# Altium schematic sheet 01_GAP9_INTERFACE.SchDoc: GAP9Shield
size A3; DrawnBy: Hanna Müller and Victor Kartsch; Organization: Integrated Systems Laboratory; DocumentNumber: 1; Revision: v1.0; SheetNumber: 1; SheetTotal: 9
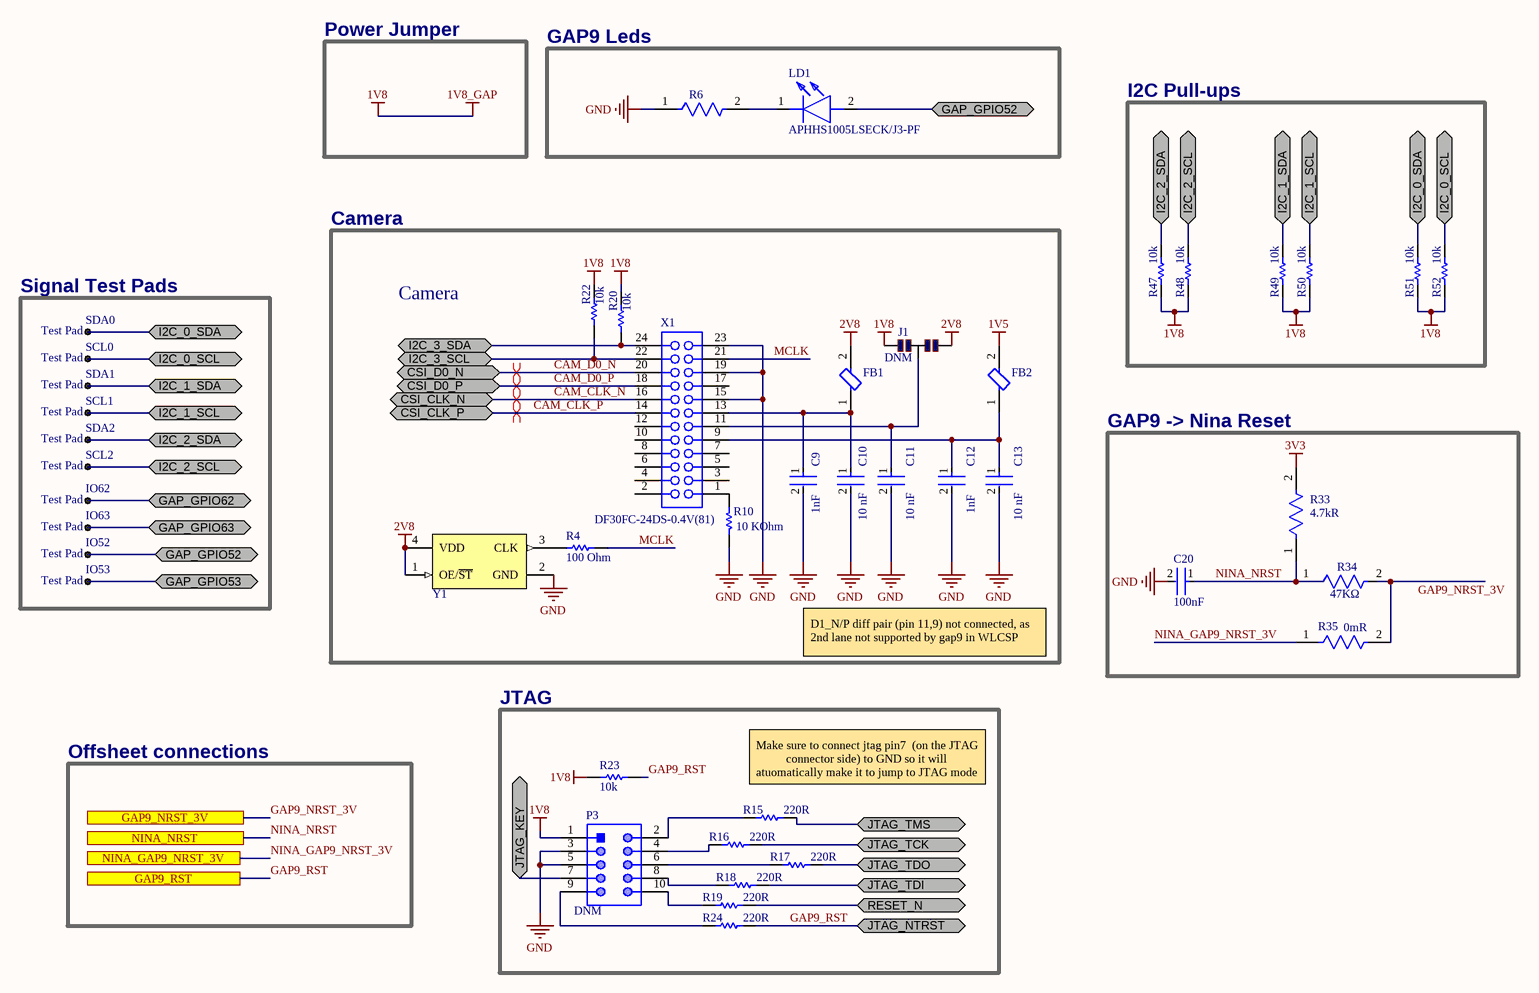
[diagram p0: 01_GAP9_INTERFACE.SchDoc]

## Parts
C9  value 1nF  [FP-GRM155-0_05-IPC_B]  (hidden comment: C0402C102F5GECAUTO)
C10  Capacitance: 10 nF  [FP-CC0402-MFG]  (hidden comment: CC0402KRX7R7BB103)
C11  Capacitance: 10 nF  [FP-CC0402-MFG]  (hidden comment: CC0402KRX7R7BB103)
C12  value 1nF  [FP-GRM155-0_05-IPC_B]  (hidden comment: C0402C102F5GECAUTO)
C13  Capacitance: 10 nF  [FP-CC0402-MFG]  (hidden comment: CC0402KRX7R7BB103)
C20  value 100nF  [FP-C1005-050-0_05-MFG]  (hidden comment: C1005X5R1E104K050BC)
FB1  BLM18HE152SN1D  [FP-BLM18-0_15-t0_8-IPC_C]  (value not drawn)
FB2  BLM18HE152SN1D  [FP-BLM18-0_15-t0_8-IPC_C]  (value not drawn)
IO52  Test Pad  [Pad-1.5mm]  (no BOM)
IO53  Test Pad  [Pad-1.5mm]  (no BOM)
IO62  Test Pad  [Pad-1.5mm]  (no BOM)
IO63  Test Pad  [Pad-1.5mm]  (no BOM)
J1  DNM  [Jumper 3 pins]  (no BOM)
LD1  APHHS1005LSECK/J3-PF  [APHHS1005LSECKJ3PF]
P3  DNM  [2x10Pin_Horizontal_50mil]
R4  value 100 Ohm  [RESC1005X40X25LL05T05]  (hidden comment: ERJ-2RKF1000X)
R6  RC0201JR-070RL  [FP-RC_L0201-MFG]  (value not drawn)
R10  value 10 KOhm  [RESC1005X40X25NL05T05]  (hidden comment: ERJ-2RKF1002X)
R15  value 220R  [RESC0603X28X15ML05T05]  (hidden comment: CRCW0201220RFKED)
R16  value 220R  [RESC0603X28X15ML05T05]  (hidden comment: CRCW0201220RFKED)
R17  value 220R  [RESC0603X28X15ML05T05]  (hidden comment: CRCW0201220RFKED)
R18  value 220R  [RESC0603X28X15ML05T05]  (hidden comment: CRCW0201220RFKED)
R19  value 220R  [RESC0603X28X15ML05T05]  (hidden comment: CRCW0201220RFKED)
R20  value 10k  [RESC0603X28X15LL05T05]  (hidden comment: CRCW020110K0FNED)
R22  value 10k  [RESC0603X28X15LL05T05]  (hidden comment: CRCW020110K0FNED)
R23  value 10k  [RESC0603X28X15LL05T05]  (hidden comment: CRCW020110K0FNED)
R24  value 220R  [RESC0603X28X15ML05T05]  (hidden comment: CRCW0201220RFKED)
R33  value 4.7kR  [FP-CRCW0402-e3-IPC_B]  (hidden comment: CRCW04024K70FKED)
R34  value 47KΩ  [FP-CRGCQ0402-IPC_C]  (hidden comment: CRGCQ0402F47K)
R35  value 0mR  [FP-CRCW0402-e3-IPC_C]  (hidden comment: CRCW04020000Z0ED)
R47  value 10k  [RESC0603X28X15LL05T05]  (hidden comment: CRCW020110K0FNED)
R48  value 10k  [RESC0603X28X15LL05T05]  (hidden comment: CRCW020110K0FNED)
R49  value 10k  [RESC0603X28X15LL05T05]  (hidden comment: CRCW020110K0FNED)
R50  value 10k  [RESC0603X28X15LL05T05]  (hidden comment: CRCW020110K0FNED)
R51  value 10k  [RESC0603X28X15LL05T05]  (hidden comment: CRCW020110K0FNED)
R52  value 10k  [RESC0603X28X15LL05T05]  (hidden comment: CRCW020110K0FNED)
SCL0  Test Pad  [Pad-1.5mm]  (no BOM)
SCL1  Test Pad  [Pad-1.5mm]  (no BOM)
SCL2  Test Pad  [Pad-1.5mm]  (no BOM)
SDA0  Test Pad  [Pad-1.5mm]  (no BOM)
SDA1  Test Pad  [Pad-1.5mm]  (no BOM)
SDA2  Test Pad  [Pad-1.5mm]  (no BOM)
X1  DF30FC-24DS-0.4V(81)  [DF30FC-24DS-0.4V(81)]
Y1  KC2520K25.0000C1GE00  [AB-24.000MAGE-T]  (value not drawn)

## Blocks framed on the sheet
GAP9 Leds: LD1 R6
I2C Pull-ups: R47-R52
Signal Test Pads: IO52 IO53 IO62 IO63 SCL0-SCL2 SDA0-SDA2
GAP9 -> Nina Reset: C20 R33-R35
JTAG: P3 R15-R19 R23 R24

## Ports
CSI_CLK_N (bidir), CSI_CLK_P (bidir), CSI_D0_N (bidir), CSI_D0_P (bidir), GAP9_NRST_3V, GAP9_RST, GAP_GPIO52 (bidir), GAP_GPIO53 (bidir), GAP_GPIO62 (bidir), GAP_GPIO63 (bidir), I2C_0_SCL (bidir), I2C_0_SDA (bidir), I2C_1_SCL (bidir), I2C_1_SDA (bidir), I2C_2_SCL (bidir), I2C_2_SDA (bidir), I2C_3_SCL (bidir), I2C_3_SDA (bidir), JTAG_KEY (bidir), JTAG_NTRST (bidir), JTAG_TCK (bidir), JTAG_TDI (bidir), JTAG_TDO (bidir), JTAG_TMS (bidir), NINA_GAP9_NRST_3V, NINA_NRST, RESET_N (bidir)

## Nets
1V5: FB2.2
1V8: J1.1 P3.1 R20.2 R22.2 R23.1 R47.1 R48.1 R49.1 R50.1 R51.1 R52.1  [also labelled 1V8_GAP]
2V8: FB1.2 J1.3 Y1.1(OE/~{ST}) Y1.4(VDD)
3V3: R33.2
GND: C9.2 C10.2 C11.2 C12.2 C13.2 C20.2 P3.3 P3.5 R6.1 R10.2 X1.15 X1.19 X1.23 Y1.2(GND)
CAM_CLK_N: X1.16 ; port CSI_CLK_N
CAM_CLK_P: X1.14 ; port CSI_CLK_P
CAM_D0_N: X1.20 ; port CSI_D0_N
CAM_D0_P: X1.18 ; port CSI_D0_P
GAP9_NRST_3V: R34.2 R35.2 ; port GAP9_NRST_3V
GAP9_RST: R23.2 R24.2 ; port JTAG_NTRST, port GAP9_RST
GAP_GPIO52: IO52.1 LD1.2(A) ; port GAP_GPIO52
GAP_GPIO53: IO53.1 ; port GAP_GPIO53
GAP_GPIO62: IO62.1 ; port GAP_GPIO62
GAP_GPIO63: IO63.1 ; port GAP_GPIO63
I2C_0_SCL: R52.2 SCL0.1 ; port I2C_0_SCL
I2C_0_SDA: R51.2 SDA0.1 ; port I2C_0_SDA
I2C_1_SCL: R50.2 SCL1.1 ; port I2C_1_SCL
I2C_1_SDA: R49.2 SDA1.1 ; port I2C_1_SDA
I2C_2_SCL: R48.2 SCL2.1 ; port I2C_2_SCL
I2C_2_SDA: R47.2 SDA2.1 ; port I2C_2_SDA
I2C_3_SCL: R22.1 X1.22 ; port I2C_3_SCL
I2C_3_SDA: R20.1 X1.24 ; port I2C_3_SDA
JTAG_KEY: P3.7 ; port JTAG_KEY
JTAG_TCK: R16.2 ; port JTAG_TCK
JTAG_TDI: R18.2 ; port JTAG_TDI
JTAG_TDO: R17.2 ; port JTAG_TDO
JTAG_TMS: R15.2 ; port JTAG_TMS
MCLK: R4.1 X1.21
NINA_GAP9_NRST_3V: R35.1 ; port NINA_GAP9_NRST_3V
NINA_NRST: C20.1 R33.1 R34.1 ; port NINA_NRST
RESET_N: R19.2 ; port RESET_N
NetC9_1: C9.1 C10.1 FB1.1 X1.13
NetC11_1: C11.1 J1.2 X1.11
NetC12_1: C12.1 C13.1 FB2.1 X1.9
NetLD1_1: LD1.1(K) R6.2
NetP3_2: P3.2 R15.1
NetP3_4: P3.4 R16.1
NetP3_6: P3.6 R17.1
NetP3_8: P3.8 R18.1
NetP3_9: P3.9 R24.1
NetP3_10: P3.10 R19.1
NetR4_2: R4.2 Y1.3(CLK)
NetR10_1: R10.1 X1.1

Not connected (* = marked no-connect by the designer): X1 2 3 4 5 6 7 8 10 12 17

## Layout directives
differential pair: CAM_CLK_N, CAM_CLK_P, CAM_D0_N, CAM_D0_P

## Notes on the sheet
- Power Jumper
- Camera
- D1_N/P diff pair (pin 11,9) not connected, as 2nd lane not supported by gap9 in WLCSP
- Offsheet connections
- (near R15) Make sure to connect jtag pin7  (on the JTAG connector side) to GND so it will atuomatically make it to jump to JTAG mode
- 1
- 2
- 3
- 4
- 5
- 6
- 7
- 8
- A
- B
- C
- D
- Project:
- Date:
- Drawing number:
- Rev:
- Format:
- A3
- Drawn by:
- Laboratory:
- Page
- Sheet:
- of
- File:

## Library data of the parts
C9 C12 = CMP-2008-04254-2: Chip Multilayer Ceramic Capacitors for General Purpose, 0402, 1000pF, C0G, 30ppm/°C, 5%, 50V; Insulation Resistance: 10GR; Packaging: Tape and Reel; Lead Free: Lead Free; Tolerance: 5%; Temperature Coefficient: 30ppm/°C; Thickness: 0.022inch; Termination: SMD/SMT; Max Operating Temperature: 125°C; Height: 0.5mm; Package Quantity: 1; Radiation Hardening: No; Material: Ceramic; Case Code (Metric): 1005; Number of Pins: 2; Voltage Rating: 50V; Mount: Surface Mount; Voltage: 50V; Case/Package: 0402; Min Operating Temperature: -55°C; Dielectric Material: Ceramic; Width: 0.5mm; Depth: 0.5mm; Case Code (Imperial): 0402; REACH SVHC: No SVHC; Dielectric: C0G; Capacitance: 1nF; Voltage Rating (DC): 50V; Length: 1mm
C10 C11 C13 = CMP-03422-000501-1: CAP CER 10000PF 16V X7R 0402; Manufacturer: YAGEO; Automotive Grade: NA; Material: Ceramic; Value: 10 nF; Tolerance: 0.1; Temperature Coefficient: 30ppm/°C; Temperature Range Low: -55°C; Temperature Range High: +125°C; Mouser Description: 0402 10 nF 16 V ±10 % Tolerance X7R SMT Multilayer Ceramic Capacitor; Footprint Url: http://www.yageo.com/exep/pages/download/literatures/UPY-C_GEN_24.pdf; Category: Cap; RoHS: TRUE; Manufacturer Part Number: CC0402KRX7R7BB103; ComponentLink2Description: Datasheet; Ipc Land Pattern Name: CAPC10050X50; Automotive: No; ComponentLink2URL: http://www.yageo.com/documents/recent/UPY-GP_NP0_16V-to-50V_16.pdf; Device Class L1: Passive Components; Height: 0.55mm; Temperature Characteristic: X7R; Package: CC0402; Voltage Rating: 16 V; Device Class L3: Ceramic Capacitors; Lead Free: Yes; Device Class L2: Capacitors; Digikey Description: CAP CER 10000PF 16V X7R 0402; Octopart: https://octopart.com/cc0402krx7r7bb103-yageo-192895; Temperature: -55°C to +125°C
C20 = CMP-2000-06000-2: Multilayer Ceramic Capacitors 100nF ±10% 25V X5R SMD 0402; Case Code (Imperial): 0402; Termination: Wraparound; Series: C; Depth: 0.5mm; Voltage Rating (DC): 25V; Contact Plating: Tin; Case Code (Metric): 1005; Dielectric: X5R; Case/Package: 0402; Voltage Rating: 25V; Packaging: Tape and Reel; Thickness: 0.022inch; Dielectric Material: Ceramic; Height: 0.5mm; Weight: 2.3E-05oz; RoHS Compliant: Yes; Width: 0.02inch; Capacitance: 100nF; Tolerance: 10%; Mount: Surface Mount; Package Quantity: 1; Max Operating Temperature: 85°C; Construction: Flat; Min Operating Temperature: -55°C; REACH SVHC: No SVHC; Resistor Type: Ceramic; Length: 1mm; Lead Free: Lead Free; Voltage: 25V
FB1 FB2 = CMP-0686-00368-3: Chip Ferrite Bead, 0603, 1500Ω @ 100MHz, 0.5Ω, 25%, 500mA; Impedance: 1.5kR; DC Resistance (DCR): 500mR; Number of Circuits: 1; value: 1.5 kOhms; Test Frequency: 100MHz; Case/Package: 0603; Max Operating Temperature: 125°C; Package Quantity: 1; Max DC Current: 500mA; Tolerance: 25%; Core Material: Ferrite; Width: 0.8mm; Number of Pins: 2; Depth: 0.8mm; Radiation Hardening: No; Case Code (Imperial): 0603; Min Operating Temperature: -55°C; Termination: SMD/SMT; Material: Ferrite; Military Standard: Not; Number of Lines: 1; DC Current: 500mA; Length: 1.6mm; REACH SVHC: No SVHC; Lead Free: Lead Free; Current Rating: 500mA; Max Current Rating: 500mA; Packaging: Tape and Reel; Case Code (Metric): 1608; Height: 0.8mm
IO52 IO53 IO62 IO63 SCL0-SCL2 SDA0-SDA2 = CMP-01283-1: 1mm SMT Test Pad; Mounting Technology: SMT
J1 = CMP-00467-5: Solder Jumper 3 Pads; Technology: SMT
LD1 = APHHS1005LSECK_J3-PF: LED; Manufacturer_Name: Kingbright; Datasheet Link: https://www.mouser.com/datasheet/2/216/APHHS1005LSECK-J3-PF-1660327.pdf; Manufacturer_Part_Number: APHHS1005LSECK/J3-PF; Mouser Part Number: 604-APHHS1005LSECKJ3; Mouser Price/Stock: https://www.mouser.co.uk/ProductDetail/Kingbright/APHHS1005LSECK-J3-PF?qs=WbpYJYa8y3339Udm5EE3iA%3D%3D; Arrow Part Number: APHHS1005LSECK/J3-PF; Arrow Price/Stock: https://www.arrow.com/en/products/aphhs1005lseckj3-pf/kingbright?region=nac
P3 = CF_JTAG_Header: 2x10 Pin 50mil Header; Supplier 1: Digi-Key; Supplier Part Number 1: 732-5374-ND
R4 = CMP-2002-00605-3: Chip Resistor, 100 Ohm, +/- 1%, 100 mW, -55 to 155 degC, 0402 (1005 Metric), RoHS, Tape and Reel; Manufacturer: Basic Passives; Power Rating: 100 mW; Voltage Rating: 50 V; Case\/Package: 0402; Width: 0.5 mm; Pins: 2; ComponentLink2Description: Datasheet; PackageReference: 0402; Height: 0.35 mm; Tolerance: 1%; DatasheetVersion: 04/2015; Case Code (Imperial): 0402; Min Operating Temperature: -55 degC; Radiation Hardening: No; Length: 1 mm; Package Quantity: 10000; PackageDescription: 2-Pin Surface Mount Device, Body 1 x 0.5 mm; Mounting Technology: Surface Mount; Case Code (Metric): 1005; Packaging: Tape and Reel; ComponentLink1URL: http://www.panasonic.com/; RoHSCompliant: true; Max Operating Temperature: 155 degC; REACH SVHC: Yes; PartNumber: ERJ-2RKF1000X; ComponentLink1Description: Manufacturer URL; Resistance: 100 Ohm; ComponentLink2URL: http://industrial.panasonic.com/cdbs/www-data/pdf/RDA0000/AOA0000C86.pdf; Mount: Surface Mount
R6 = CMP-03412-023265-1: RES SMD 0 OHM JUMPER 1/20W 0201; Manufacturer: Yageo; Power Rating: 50mW; Value: 0Ω; Temperature Coefficient: 200ppm/°C; Voltage Rating: 25V; Tolerance: 5%; Octopart: https://octopart.com/rc0201jr-070rl-yageo-43171986; ComponentLink2URL: http://www.yageo.com/documents/recent/PYu-RC_Group_51_RoHS_L_10.pdf; Device Class L2: Resistors; Series: RC_L; Ipc Land Pattern Name: RESC6030X23; Temperature: -55°C to +125°C; Mouser Description: Thick Film Resistors ZERO OHM JUMPER; Footprint Url: http://www.yageo.com/exep/pages/download/literatures/PYu-R_Mount_10.pdf; RoHS: TRUE; Package: RC_L0201; Device Class L3: Chip SMD Resistors; Temperature Range Low: -55°C; Composition: Thick Film; ComponentLink2Description: Datasheet; Height: 0.26mm; Device Class L1: Passive Components; Category: Res; Resistance: 0Ω; Manufacturer Part Number: RC0201JR-070RL; Temperature Range High: +125°C; Automotive: No; Lead Free: Yes; Digikey Description: RES SMD 0 OHM JUMPER 1/20W 0201
R10 = CMP-2002-00607-3: Chip Resistor, 10 KOhm, +/- 1%, 100 mW, -55 to 155 degC, 0402 (1005 Metric), RoHS, Tape and Reel; Manufacturer: Basic Passives; Case\/Package: 0402; Voltage Rating: 50 V; Power Rating: 100 mW; Packaging: Tape and Reel; Width: 0.5 mm; Package Quantity: 10000; Radiation Hardening: No; Min Operating Temperature: -55 degC; Case Code (Imperial): 0402; REACH SVHC: Yes; PackageDescription: 2-Pin Surface Mount Device, Body 1 x 0.5 mm; Length: 1 mm; ComponentLink1Description: Manufacturer URL; PackageReference: 0402; RoHSCompliant: true; Resistance: 10 KOhm; ComponentLink1URL: http://www.panasonic.com/; Height: 0.35 mm; ComponentLink2Description: Datasheet; DatasheetVersion: 04/2015; Mounting Technology: Surface Mount; ComponentLink2URL: http://industrial.panasonic.com/cdbs/www-data/pdf/RDA0000/AOA0000C86.pdf; Max Operating Temperature: 155 degC; Pins: 2; Tolerance: 1%; PartNumber: ERJ-2RKF1002X; Case Code (Metric): 1005; Mount: Surface Mount
R15-R19 R24 = CMP-2004-00982-1: Manufacturer: Vishay Dale; Part Number: CRCW0201220RFKED
R20 R22 R23 R47-R52 = CMP-2004-00016-1: Manufacturer: Vishay Dale; Part Number: CRCW020110K0FNED
R33 = CMP-2002-00051-3: RES Thick Film, 4.7kΩ, 1%, 0.063W, 100ppm/°C, 0402; Voltage Rating (DC): 50V; Power Rating: 63mW; Termination: SMD/SMT; Military Standard: Not; Length: 1mm; Radiation Hardening: No; Max Operating Temperature: 155°C; Min Operating Temperature: -55°C; Package Quantity: 10; Width: 0.5mm; Case Code (Imperial): 0402; Number of Terminations: 2; Max Power Dissipation: 63mW; Tolerance: 1%; Features: Automotive AEC-Q200; Composition: Thick Film; Depth: 0.5mm; Mount: Surface Mount; Weight: 2.3E-05oz; Lead Free: Lead Free; Case/Package: 0402; Height: 0.35mm; Packaging: Tape and Reel; Temperature Coefficient: 100ppm/°C; Case Code (Metric): 1005; Voltage Rating: 50V; Contact Plating: Tin; Resistance: 4.7kR
R34 = CMP-03211-001552-1: CRGCQ0402 47KΩ 1% ±100ppm/°C 50V; Manufacturer: TE Connectivity; Power Rating: 0.0625W; Tolerance: 0.01; Lead Free: Yes; Temperature Range Low: -55°C; Composition: Thick Film; Temperature Range High: +155°C; Octopart: https://octopart.com/crgcq0402f47k-te+connectivity-91017973; Ipc Land Pattern Name: RESC10050X35; Series: CRGCQ; Device Class L2: Resistors; Temperature: -55°C to +155°C; ComponentLink2URL: https://www.te.com/commerce/DocumentDelivery/DDEController?Action=showdoc&DocId=Data+Sheet%7F1773204-3%7F1%7Fpdf%7FEnglish%7FENG_DS_1773204-3_1.pdf%7F4-2176347-1074; RoHS: TRUE; Package: CRGCQ0402; Voltage Rating: 50V; Resistance: 47KΩ; Temperature Coefficient: ±100ppm/°C; Ambient Temperature Range High: +70°C; Category: Res; Height: 0.4mm; Device Class L1: Passive Components; Manufacturer Part Number: CRGCQ0402F47K; Device Class L3: Chip SMD Resistors; ComponentLink2Description: Datasheet; Automotive: Yes
R35 = CMP-2002-08122-2: RES Thick Film, 0Ω, 0.063W, 0402; Tolerance: 5%; Max Power Dissipation: 63mW; Voltage Rating: 50V; Temperature Coefficient: 100ppm/°C; Contact Plating: Tin; Height: 0.35mm; Radiation Hardening: No; Features: Automotive AEC-Q200; Composition: Thick Film; Width: 0.5mm; Weight: 2.3E-05oz; Termination: SMD/SMT; Packaging: Tape and Reel; Mount: Surface Mount; Case Code (Metric): 1005; Military Standard: Not; Min Operating Temperature: -55°C; Number of Terminations: 2; Package Quantity: 1; Case Code (Imperial): 0402; Depth: 0.5mm; Max Operating Temperature: 155°C; Case/Package: 0402; Resistance: 0mR; Power Rating: 63mW; Lead Free: Lead Free; Voltage Rating (DC): 50V; Length: 1mm
X1 = CMP-02115-1: Board Connector, 24 Contact(s), 2 Row(s), Female, Straight, 0.016 inch Pitch, Surface Mount Terminal, Locking, Black Insulator, Receptacle; MIL Conformance: No; Insulation Resistance: 50MR; Durability: 50Cycles; Mating Information: MULTIPLE MATING PARTS AVAILABLE; Rated Current (Signal): 300mA; PCB Contact Pattern: RECTANGULAR; Contact Resistance: 100mR; Body Breadth: 0.18inch; PCB Contact Row Spacing: 4.1656mm; Reference Standard: UL; Reliability: COMMERCIAL; Number Of Connectors: 1; Additional Feature: Low Profile; Number of Rows Loaded: 2; Body Depth: 0.035inch; Number of Contacts: 24; Option: General Purpose; Body Length: 0.234inch; Dielectric Withstanding Voltage (AC): 100V; Termination: SMD/SMT; Mounting Style: STRAIGHT; Contact Finish - Termination: GOLD; Mount: Board; Contact Gender: Female; DIN Conformance: No; Body/Shell Style: RECEPTACLE; Max Operating Temperature: 85°C; Insulation Material: Polymer; Insulation Color: Black; Mixed Contacts: No; Contact Pattern: RECTANGULAR; Connector Type: BOARD CONNECTOR; Contact Finish - Mating: GOLD; Mating Contact Pitch: 0.016inch; RoHS Compliant: Yes; Terminal Pitch: 0.4mm; Mounting Option 1: LOCKING; REACH SVHC: No SVHC; IEC Conformance: No; Flammability Rating: UL94 V-0; JESD-609 Code: e4; Contact Material: Bronze; Filter Feature: No; Number Of PCB Rows: 2; Min Operating Temperature: -35°C
Y1 = SiT8008: OSCILLATOR XO 25.000MHZ CMOS SMD; Manufacturer: AVX-Corp-Kyocera-Corp; Frequency: 25MHz; Function: Standby (Power Down); Voltage - Supply: 1.8V, 2.5V, 3.3V; Frequency Stability: ±50ppm; Current - Supply (Max): 3.5mA; Current - Supply (Disable) (Max): 10µA; Category: Crystals and Oscillators; Family: Oscillators; Series: KC2520B-C1, Kyocera; Packaging: Tape &amp; Reel (TR); Type: XO (Standard); ComponentLink1Description: kc2520b_c1_e-514106.pdf; ComponentLink1URL: http://www.mouser.com/ds/2/40/kc2520b_c1_e-514106.pdf; ComponentLink2Description: 0323_03086292; ComponentLink2URL: http://components.arrow.com/part/dataview/0323_03086292; Output: CMOS; Operating Temperature: -40°C ~ 85°C; Ratings: -; Mounting Type: Surface Mount; Size / Dimension: 0.098" L x 0.079" W (2.50mm x 2.00mm); Height: 0.028" (0.70mm); Package / Case: 4-SMD, No Lead (DFN, LCC); Manufacturer Part Number: KC2520K25.0000C1GE00; Supplier: Digikey; Supplier Part Number: 1253-1237-2-ND